# Altium schematic sheet 13_CEP.SchDoc
size A3
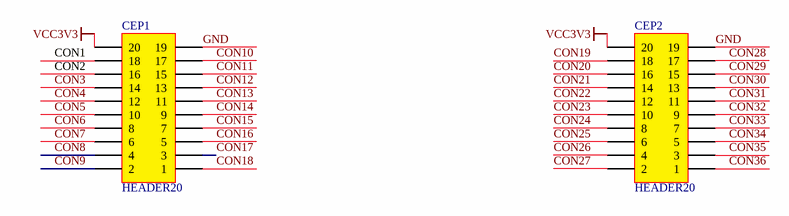
[diagram p0: 13_CEP.SchDoc]

## Parts
CEP1  HEADER20  [HEADER10X2X2.5]
CEP2  HEADER20  [HEADER10X2X2.5]

## Nets
VCC3V3: CEP1.20 CEP2.20
CON1: CEP1.18
CON2: CEP1.16
CON3: CEP1.14
CON4: CEP1.12
CON5: CEP1.10
CON6: CEP1.8
CON7: CEP1.6
CON8: CEP1.4
CON9: CEP1.2
CON10: CEP1.17
CON11: CEP1.15
CON12: CEP1.13
CON13: CEP1.11
CON14: CEP1.9
CON15: CEP1.7
CON16: CEP1.5
CON17: CEP1.3
CON18: CEP1.1
CON19: CEP2.18
CON20: CEP2.16
CON21: CEP2.14
CON22: CEP2.12
CON23: CEP2.10
CON24: CEP2.8
CON25: CEP2.6
CON26: CEP2.4
CON27: CEP2.2
CON28: CEP2.17
CON29: CEP2.15
CON30: CEP2.13
CON31: CEP2.11
CON32: CEP2.9
CON33: CEP2.7
CON34: CEP2.5
CON35: CEP2.3
CON36: CEP2.1
GND: CEP1.19 CEP2.19

## Library data of the parts
CEP1 CEP2 = HEADER10X2